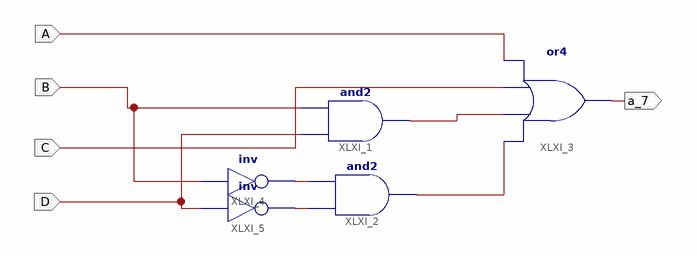
[diagram p0: schematic sheet 1]
// Xilinx ISE schematic a_7.sch (spartan6) as structural Verilog: 5 symbols, 5 ports
module a_7 (
  input  A,
  input  B,
  input  C,
  input  D,
  output a_7
);

  wire XLXN_8, XLXN_9, XLXN_10, XLXN_13;

  not XLXI_5 (XLXN_10, D);
  not XLXI_4 (XLXN_9, B);
  and XLXI_2 (XLXN_13, XLXN_10, XLXN_9);
  or XLXI_3 (a_7, XLXN_13, XLXN_8, C, A);
  and XLXI_1 (XLXN_8, D, B);
endmodule
